# Altium project Rpiadapter_V3.PrjPcb
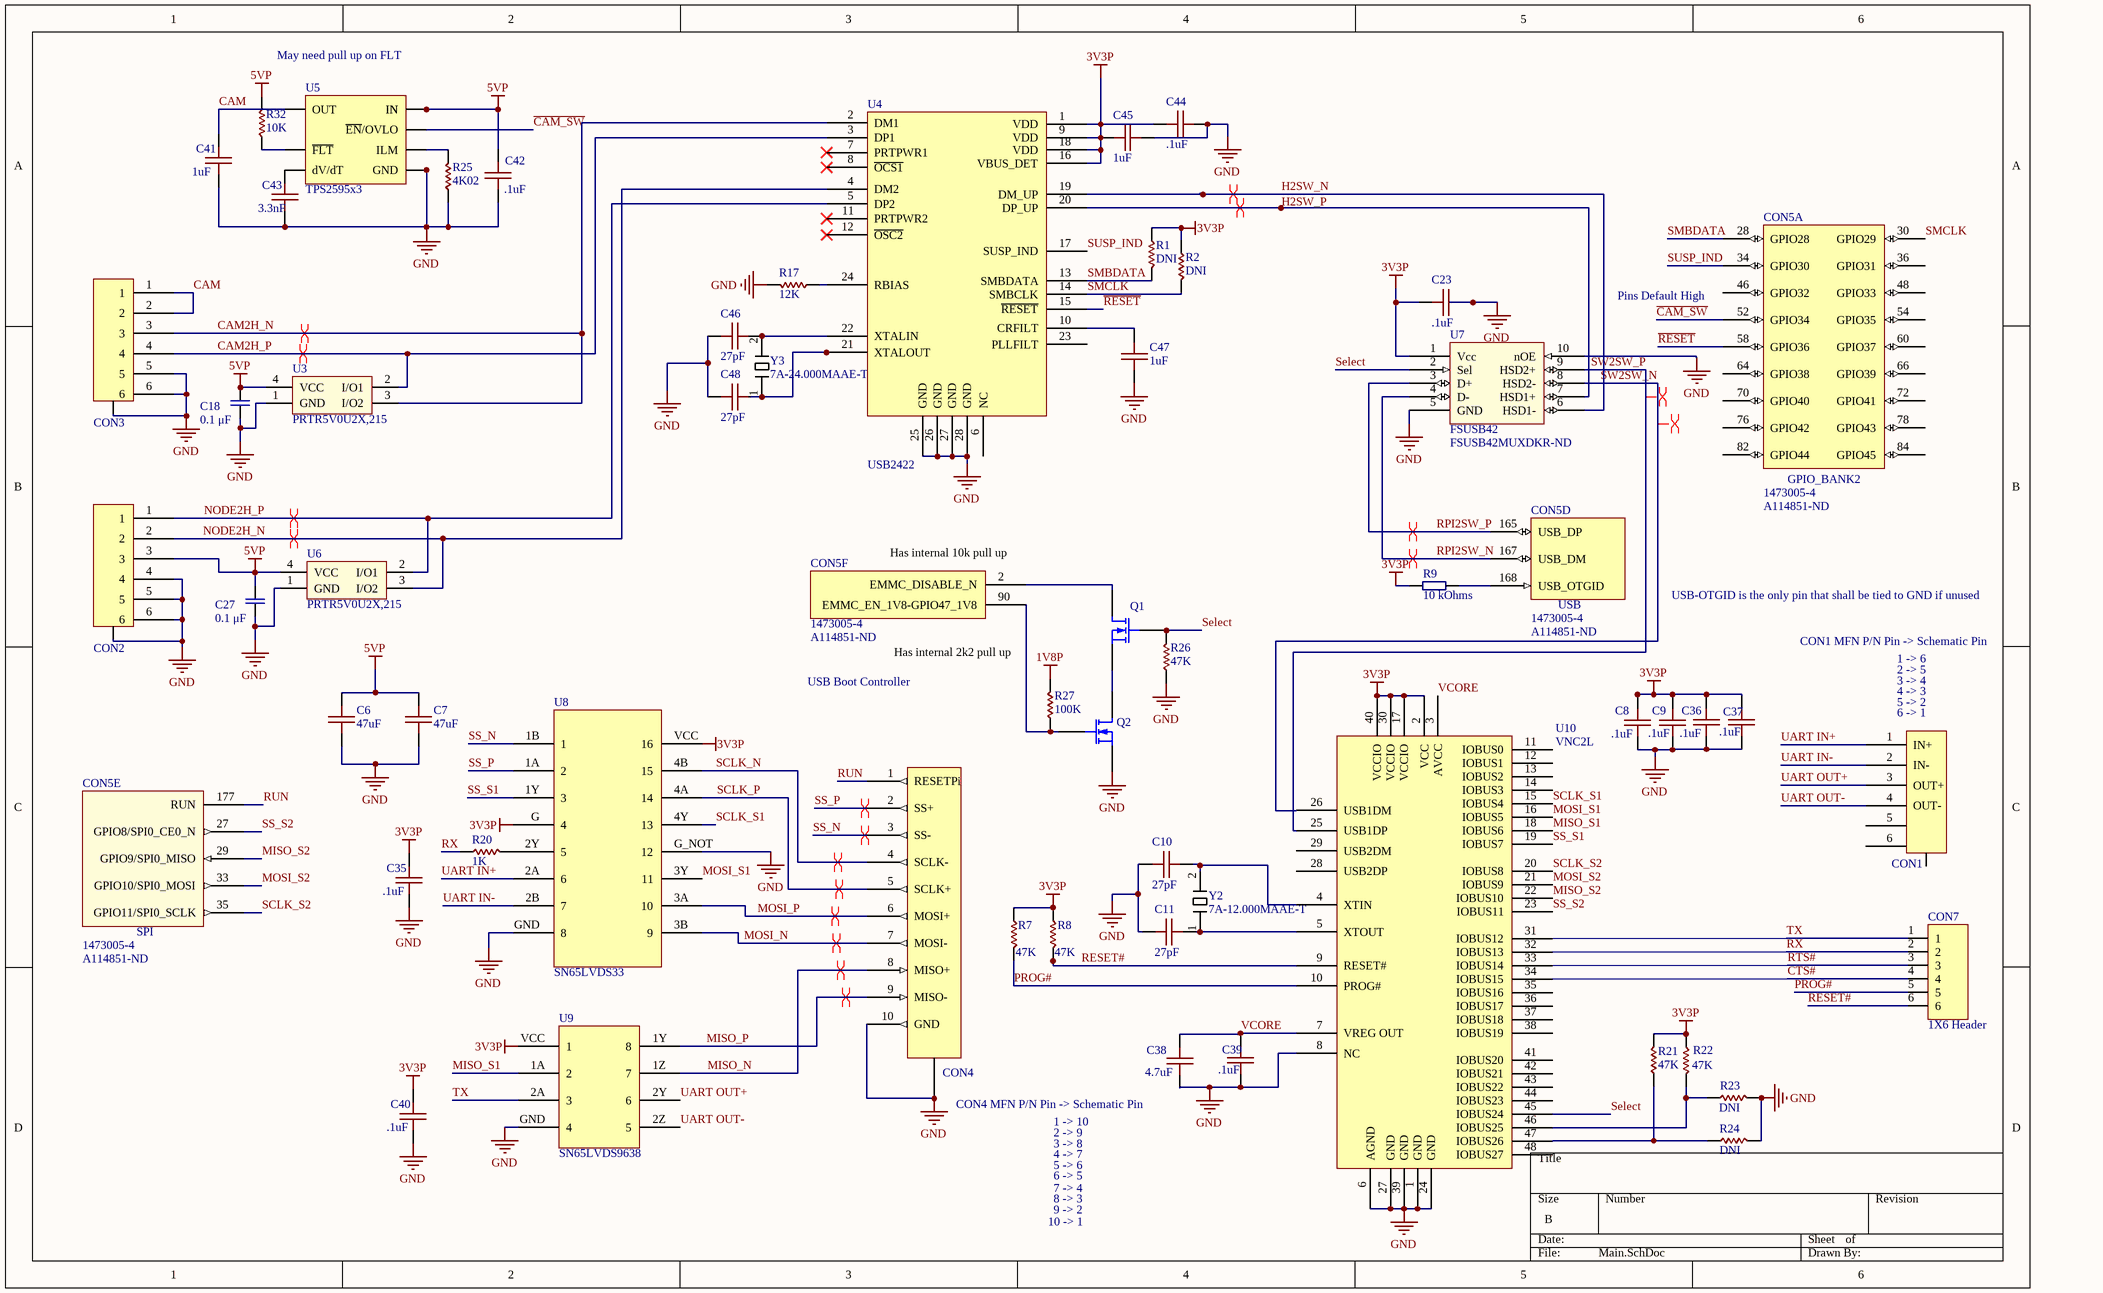
[diagram p0: Main.SchDoc]
3 sheets, 86 parts. Net scope: global (net labels, ports and power ports of the same name join across sheets).
Board file: RPIadaptor.PcbDoc
Sheets:
  Main.SchDoc
  Misc.SchDoc
  Power.SchDoc

## Sheet Main.SchDoc
size B

### Parts
C6  47uF  [0805 B]
C7  47uF  [0805 B]
C8  .1uF  [0402 B]
C9  .1uF  [0603 B]
C10  27pF  [0402 B]
C11  27pF  [0402 B]
C18  Capacitance: 0.1 μF  [0805_X7R_KEMET]  (hidden comment: C0805C104K5RACTU)
C23  .1uF  [0402 B]
C27  Capacitance: 0.1 μF  [0805_X7R_KEMET]  (hidden comment: C0805C104K5RACTU)
C35  .1uF  [0402 B]
C36  .1uF  [0402 B]
C37  .1uF  [0402 B]
C38  4.7uF  [0805 B]
C39  .1uF  [0402 B]
C40  .1uF  [0402 B]
C41  1uF  [0402 B]
C42  .1uF  [0402 B]
C43  3.3nF  [0402 B]
C44  .1uF  [0402 B]
C45  1uF  [0402 B]
C46  27pF  [0402 B]
C47  1uF  [0402 B]
C48  27pF  [0402 B]
CON1  T1M-06-F-SH-L-K  [T1M-06-F-SH-L-K]  (value not drawn)
CON2  T1M-06-F-SH-L-K  [T1M-06-F-SH-L-K]  (value not drawn)
CON3  0532610671  [0532610671]  (value not drawn)
CON4  T1M-10-F-SH-L-K  [T1M-10-F-SH-L-K]  (value not drawn)
CON5  1473005-4  Supplier Part Number 1: A114851-ND  [SODIMM SOCKET .6 PITCH 200 POS RIGHT ANGLE]  (parts A,D,E,F of 9)
CON7  1X6 Header  [1X6 HEADER]
Q1  DMG1012T-7  [SOT523]  (value not drawn)
Q2  DMG1012T-7  [SOT523]  (value not drawn)
R1  DNI  [0402]
R2  DNI  [0402]
R7  47K  [0402]
R8  47K  [0402]
R9  Resistance: 10 kOhms  [CRCW0805_VISHAY]  (hidden comment: jcc)
R17  12K  [0402]
R20  1K  [0402]
R21  47K  [0402]
R22  47K  [0402]
R23  DNI  [0402]
R24  DNI  [0402]
R25  4K02  [0402]
R26  47K  [0402]
R27  100K  [0402]
R32  10K  [0402]
U3  PRTR5V0U2X,215  [SOT143B]
U4  USB2422  [QFN-24]
U5  TPS2595x3  [SON8 (2x2)]
U6  PRTR5V0U2X,215  [SOT143B]
U7  FSUSB42  Supplier Part Number 1: FSUSB42MUXDKR-ND  [MSOP-10]
U8  SN65LVDS33  [SOIC127P820X265-8N]
U9  SN65LVDS9638  [SN65LVDS31]
U10  VNC2L  [VNC2L]
Y2  7A-12.000MAAE-T  [7A-12.000]
Y3  7A-24.000MAAE-T  [7A-12.000]

### Nets
1V8P: R27.1
3V3P: C8.1 C9.1 C23.1 C35.1 C36.1 C37.1 C40.1 C44.1 C45.1 R1.2 R2.2 R7.2 R8.2 R9.1 R21.1 R22.2 U4.1(VDD) U4.9(VDD) U4.16(VBUS_DET) U4.18(VDD) U7.1(Vcc) U8.G(4) U8.VCC(16) U9.VCC(1) U10.2(VCC) U10.17(VCCIO) U10.30(VCCIO) U10.40(VCCIO)
5VP: C6.2 C7.2 C18.1 C27.1 C42.1 CON2.3 R32.1 U3.4(VCC) U5.3(IN) U5.4(IN) U6.4(VCC)
GND: C6.1 C7.1 C8.2 C9.2 C10.2 C11.2 C18.2 C23.2 C27.2 C35.2 C36.2 C37.2 C38.1 C39.2 C40.2 C41.2 C42.2 C43.2 C44.2 C45.2 C46.2 C47.2 C48.2 CON2.4 CON2.5 CON2.6 CON2.GND CON3.5 CON3.6 CON3.GND CON4.10(GND) CON4.GND Q2.3(S) R17.1 R23.1 R24.1 R25.2 R26.2 U3.1(GND) U4.25(GND) U4.26(GND) U4.27(GND) U4.28(GND) U5.8(GND) U5.9 U6.1(GND) U7.5(GND) U7.10(nOE) U8.G_NOT(12) U8.GND(8) U9.GND(4) U10.1(GND) U10.6(AGND) U10.8(NC) U10.24(GND) U10.27(GND) U10.39(GND)
~{CAM_SW}: CON5.52(GPIO34) U5.2(~{EN}/OVLO)
CAM: C41.1 CON3.1 CON3.2 U5.5(OUT)
CAM2H_N: CON3.3 U3.3(I/O2) U4.2(DM1)
CAM2H_P: CON3.4 U3.2(I/O1) U4.3(DP1)
CTS#: CON7.4 U10.34(IOBUS15)
H2SW_N: U4.19(DM_UP) U7.6(HSD1-)
H2SW_P: U4.20(DP_UP) U7.7(HSD1+)
MISO_N: CON4.8(MISO+) U9.1Z(7)
MISO_P: CON4.9(MISO-) U9.1Y(8)
MISO_S1: U9.1A(2) U10.18(IOBUS6)
MISO_S2: CON5.29(GPIO9/SPI0_MISO) U10.22(IOBUS10)
MOSI_N: CON4.7(MOSI-) U8.3B(9)
MOSI_P: CON4.6(MOSI+) U8.3A(10)
MOSI_S1: U8.3Y(11) U10.16(IOBUS5)
MOSI_S2: CON5.33(GPIO10/SPI0_MOSI) U10.21(IOBUS9)
NODE2H_N: CON2.2 U4.4(DM2) U6.3(I/O2)
NODE2H_P: CON2.1 U4.5(DP2) U6.2(I/O1)
PROG#: CON7.5 R7.1 U10.10(PROG#)
~{RESET}: CON5.58(GPIO36) U4.15(~{RESET})
RESET#: CON7.6 R8.1 U10.9(RESET#)
RPI2SW_N: CON5.167(USB_DM) U7.4(D-)
RPI2SW_P: CON5.165(USB_DP) U7.3(D+)
RTS#: CON7.3 U10.33(IOBUS14)
RUN: CON4.1(RESETPi) CON5.177(RUN)
RX: CON7.2 R20.2 U10.32(IOBUS13)
SCLK_N: CON4.4(SCLK-) U8.4B(15)
SCLK_P: CON4.5(SCLK+) U8.4A(14)
SCLK_S1: U8.4Y(13) U10.15(IOBUS4)
SCLK_S2: CON5.35(GPIO11/SPI0_SCLK) U10.20(IOBUS8)
Select: Q1.2(G) R26.1 U7.2(Sel) U10.45(IOBUS24)
SMBDATA: CON5.28(GPIO28) R1.1 U4.13(SMBDATA)
SMCLK: CON5.30(GPIO29) R2.1 U4.14(SMBCLK)
SS_N: CON4.3(SS-) U8.1B(1)
SS_P: CON4.2(SS+) U8.1A(2)
SS_S1: U8.1Y(3) U10.19(IOBUS7)
SS_S2: CON5.27(GPIO8/SPI0_CE0_N) U10.23(IOBUS11)
SUSP_IND: CON5.34(GPIO30) U4.17(SUSP_IND)
SW2SW_N: U7.8(HSD2-) U10.26(USB1DM)
SW2SW_P: U7.9(HSD2+) U10.25(USB1DP)
TX: CON7.1 U9.2A(3) U10.31(IOBUS12)
UART IN+: CON1.1(IN+) U8.2A(6)
UART IN-: CON1.2(IN-) U8.2B(7)
UART OUT+: CON1.3(OUT+) U9.2Y(6)
UART OUT-: CON1.4(OUT-) U9.2Z(5)
VCORE: C38.2 C39.1 U10.3(AVCC) U10.7(VREG_OUT)
NetC10_1: C10.1 U10.4(XTIN) Y2.2
NetC11_1: C11.1 U10.5(XTOUT) Y2.1
NetC43_1: C43.1 U5.1(dV/dT)
NetC46_1: C46.1 U4.22(XTALIN) Y3.2
NetC47_1: C47.1 U4.10(CRFILT)
NetC48_1: C48.1 U4.21(XTALOUT) Y3.1
NetCON5_2: CON5.2(EMMC_DISABLE_N) Q1.1(D)
NetCON5_90: CON5.90(EMMC_EN_1V8-GPIO47_1V8) Q2.2(G) R27.2
NetCON5_168: CON5.168(USB_OTGID) R9.2
NetQ1_3: Q1.3(S) Q2.1(D)
NetR17_2: R17.2 U4.24(RBIAS)
NetR20_1: R20.1 U8.2Y(5)
NetR21_2: R21.2 R24.2 U10.47(IOBUS26)
NetR22_1: R22.1 R23.2 U10.46(IOBUS25)
NetR25_1: R25.1 U5.7(ILM)
NetR32_2: R32.2 U5.6(~{FLT})

Not connected (* = marked no-connect by the designer): CON1 5 6 GND; CON5 36(GPIO31) 46(GPIO32) 48(GPIO33) 54(GPIO35) 60(GPIO37) 64(GPIO38) 66(GPIO39) 70(GPIO40) 72(GPIO41) 76(GPIO42) 78(GPIO43) 82(GPIO44) 84(GPIO45); U4 6(NC) 7(PRTPWR1)* 8(~{OCS1})* 11(PRTPWR2)* 12(~{OSC2})* 23(PLLFILT); U10 11(IOBUS0) 12(IOBUS1) 13(IOBUS2) 14(IOBUS3) 28(USB2DP) 29(USB2DM) 35(IOBUS16) 36(IOBUS17) 37(IOBUS18) 38(IOBUS19) 41(IOBUS20) 42(IOBUS21) 43(IOBUS22) 44(IOBUS23) 48(IOBUS27)

### Layout directives
differential pair: CAM2H_N, CAM2H_P, H2SW_N, H2SW_P, MISO_N, MISO_P, MOSI_N, MOSI_P, NODE2H_N, NODE2H_P, RPI2SW_N, RPI2SW_P, SCLK_N, SCLK_P, SS_N, SS_P, SW2SW_N, SW2SW_P

### Notes on the sheet
- May need pull up on FLT
- (near CON5) Pins Default High
- (near CON5) Has internal 10k pull up
- USB-OTGID is the only pin that shall be tied to GND if unused
- USB Boot Controller
- Has internal 2k2 pull up
- CON1 MFN P/N Pin -> Schematic Pin
- 1 -> 6
- 2 -> 5
- 3 -> 4
- (near CON1) 4 -> 3
- (near CON1) 5 -> 2
- (near CON1) 6 -> 1
- CON4 MFN P/N Pin -> Schematic Pin
- 1 -> 10
- 2 -> 9
- 3 -> 8
- 4 -> 7
- 5 -> 6
- 6 -> 5
- 10 -> 1
- 7 -> 4
- 8 -> 3
- 9 -> 2
- (in symbol 1473005-4, part A) GPIO_BANK2
- (in symbol 1473005-4, part D) USB
- (in symbol 1473005-4, part E) SPI

### Library data of the parts
C6 = CAP 0805: 0805 CAP; Value: 47uF; Parameter 1: *
C7 C38 = CAP 0805: 805 Capacitor
  C7: Value: 47uF
C8 C23 C35 C36 C40-C43 = CAP 0402
C9 = CAP 0603: 603 Capacitor
C10 C11 C37 C39 C46 C48 = CAP 0402: CBR04C680F3GAC
C18 C27 = C0805C104K5RACTU: Manufacturer: Kemet; Manufacturer Part Number: C0805C104K5RAC-TU; Brand/Series: C Series; Dielectric Characteristic: X7R; Material, Element: Ceramic; Tolerance: -10, +10 %; Voltage, Rating: 50 VDC; Supplier 1: Digikey; Stock 1: 2895664; Pricing 1: 1=0.1, 10=0.053, 25=0.0388, 50=0.029, 100=0.0237, 250=0.0198, 500=0.0169, 1000=0.0133 (USD); Case Size: 0805 (2012 mm); Dimensions: 0.079" x 0.049" (2 x 1.25mm) LxW; Mounting Type: PCB; Packaging: Cut Tape; Termination: SMD; ComponentLink1URL: https://datasheet.ciiva.com/14589/70095383-14589048.pdf; ComponentLink1Description: https://datasheet.ciiva.com/14589/70095383-14589048.pdf; ComponentLink2URL: https://datasheet.ciiva.com/28682/1851736-28682232.pdf; ComponentLink2Description: https://datasheet.ciiva.com/28682/1851736-28682232.pdf; ComponentLink3URL: https://datasheet.ciiva.com/7842/1851736-7842539.pdf; ComponentLink3Description: https://datasheet.ciiva.com/7842/1851736-7842539.pdf; ComponentLink4URL: https://datasheet.ciiva.com/32431/slceramic-chip-condensers-e-32431755.pdf; ComponentLink4Description: https://datasheet.ciiva.com/32431/slceramic-chip-condensers-e-32431755.pdf; ComponentLink5URL: https://datasheet.ciiva.com/18410/70095383-18410815.pdf; ComponentLink5Description: https://datasheet.ciiva.com/18410/70095383-18410815.pdf; Supplier Part Number 1: 399-1170-1-ND
C44 C45 = CAP 0402: 402 cap
C47 = CAP 0402: 402
CON1 CON2 = T1M-06-F-SH-L-K: 6 Positions Header Connector Surface Mount, Right Angle; Manufacturer: Samtec; Supplier 1: Digi-Key; Manufacturer Part Number: T1M-06-F-SH-L-K; Stock 1: 0; Supplier Part Number 1: SAM11991-ND
CON3 = 0532610671: CONN HEADER 6POS 1.25MM R/A SMD; Manufacturer: Molex; Number of Contacts: 6; Gender: HDR; Supplier 1: Digi-Key; Manufacturer Part Number: 0532610671; Stock 1: 23842; Supplier Part Number 1: WM7624CT-ND; Pricing 1: 1=1.37, 10=1.239, 100=1.0624, 500=0.8853 (USD); Packaging: Cut Tape; Type: Shrouded Header; Pitch: 1.25 mm; Number of Rows: 1; Contact Plating: Tin Over Nickel; Termination Method: Solder; Category: Connector Headers and PCB Receptacles; ComponentLink1URL: https://datasheet.ciiva.com/6813/532610671-sd-6813952.pdf; ComponentLink1Description: https://datasheet.ciiva.com/6813/532610671-sd-6813952.pdf; ComponentLink2URL: https://datasheet.ciiva.com/3933/353410532610671-pcb-headers-3933365.pdf; ComponentLink2Description: https://datasheet.ciiva.com/3933/353410532610671-pcb-headers-3933365.pdf; ComponentLink3URL: https://datasheet.ciiva.com/6813/532610671-sd-6813942.pdf; ComponentLink3Description: https://datasheet.ciiva.com/6813/532610671-sd-6813942.pdf; ComponentLink4URL: https://datasheet.ciiva.com/3117/0532610671-pcb-headers-3117609.pdf; ComponentLink4Description: https://datasheet.ciiva.com/3117/0532610671-pcb-headers-3117609.pdf; ComponentLink5URL: https://datasheet.ciiva.com/3117/0532610671-pcb-headers-3117610.pdf; ComponentLink5Description: https://datasheet.ciiva.com/3117/0532610671-pcb-headers-3117610.pdf; ComponentLink6URL: https://datasheet.ciiva.com/6813/532610671-sd-6813947.pdf; ComponentLink6Description: https://datasheet.ciiva.com/6813/532610671-sd-6813947.pdf; ComponentLink7URL: https://datasheet.ciiva.com/48768/0532610671-pcb-headers-48768267.pdf; ComponentLink7Description: https://datasheet.ciiva.com/48768/0532610671-pcb-headers-48768267.pdf
CON4 = T1M-10-F-SH-L-K: 10 Positions Header Connector Surface Mount, Right Angle
CON5 = 1473005-4: Manufacturer: TE Connectivity (Tyco Electronics); Unit PriceUSD: AMP; Minimum Quantity: SODIMM; 3D Model: 1473005-4.pdf; Number of Positions: 200; Memory Type: DDR 2 SDRAM; Other Names: 1473005-4-ND / A114851; Supplier 1: Digikey; Manufacturer Part Number: 1473005-4; Stock 1: 1922; Pricing 1: 1=3.9, 10=3.744, 50=3.276, 100=3.12, 250=2.73, 500=2.652, 1000=2.262, 2500=2.106 (USD); Quantity Available: Tray; RoHS Information: 1473005-4 Statement of Compliance / RoHS 2 Statement; Standard Package: 20; Category: Connectors, Interconnects; Family: Memory Connectors - Inline Module Sockets; Series: AMP; Packaging: Tray; Connector Style: SODIMM; Mounting Type: Surface Mount, Right Angle; Features: Board Guide, Latches; Mounting Feature: Standard; Contact Finish: Gold; Contact Finish Thickness: Flash; ComponentLink1URL: https://datasheet.ciiva.com/682/eng-cd-1473005-j2-682720.pdf; ComponentLink1Description: https://datasheet.ciiva.com/682/eng-cd-1473005-j2-682720.pdf; ComponentLink2URL: https://datasheet.ciiva.com/15171/getdatasheetpartid-99150-15171488.pdf; ComponentLink2Description: https://datasheet.ciiva.com/15171/getdatasheetpartid-99150-15171488.pdf; ComponentLink3URL: https://datasheet.ciiva.com/1105/582309-1105221.pdf; ComponentLink3Description: https://datasheet.ciiva.com/1105/582309-1105221.pdf; ComponentLink4URL: https://datasheet.ciiva.com/682/eng-cd-1473005-j2-682726.pdf; ComponentLink4Description: https://datasheet.ciiva.com/682/eng-cd-1473005-j2-682726.pdf; ComponentLink5URL: https://datasheet.ciiva.com/14156/04821302-14156311.pdf; ComponentLink5Description: https://datasheet.ciiva.com/14156/04821302-14156311.pdf; ComponentLink6URL: https://datasheet.ciiva.com/3136/eng-cd-1473005-j-3136060.pdf; ComponentLink6Description: https://datasheet.ciiva.com/3136/eng-cd-1473005-j-3136060.pdf; ComponentLink7URL: https://datasheet.ciiva.com/16380/eng-cd-1473005-j-16380909.pdf; ComponentLink7Description: https://datasheet.ciiva.com/16380/eng-cd-1473005-j-16380909.pdf; ComponentLink8URL: https://datasheet.ciiva.com/16651/eng-cd-1473005-j-16651646.pdf; ComponentLink8Description: https://datasheet.ciiva.com/16651/eng-cd-1473005-j-16651646.pdf
Q1 Q2 = DMG1012T-7: N-Channel MOSFET; Manufacturer: Diodes; Drain-Source On Resistance-Max: 400 mO; Drain-to-Source Voltage [Vdss]: 20 V; Qg Gate Charge: 0.74 nC; Rated Power Dissipation: 280 mW; Published: 8-Jun-2000; LatestRevisionDate: 17-Jul-2002; LatestRevisionNote: Re-released for DXP Platform.; PackageVersion: 1995/1996; PackageReference: E3; Publisher: Altium Limited; PackageDescription: TO, Flat Index; 3 In-Line, Axial Leads; Body Dia. 4.6mm; Lead Dia. 0.5 mm (max); Supplier 1: Digikey; Manufacturer Part Number: DMG1012T-7; Stock 1: 327; Pricing 1: 1=0.33, 10=0.268, 100=0.1421, 500=0.0935, 1000=0.0636 (USD); Channel Type: N-Channel; ComponentLink1URL: https://datasheet.ciiva.com/934/ds31783-934512.pdf; ComponentLink1Description: https://datasheet.ciiva.com/934/ds31783-934512.pdf; ComponentLink2URL: https://datasheet.ciiva.com/4442/ds31783-44973-4442944.pdf; ComponentLink2Description: https://datasheet.ciiva.com/4442/ds31783-44973-4442944.pdf; ComponentLink3URL: https://datasheet.ciiva.com/11174/ds31783-11174965.pdf; ComponentLink3Description: https://datasheet.ciiva.com/11174/ds31783-11174965.pdf; ComponentLink4URL: https://datasheet.ciiva.com/17324/ds31783-17324010.pdf; ComponentLink4Description: https://datasheet.ciiva.com/17324/ds31783-17324010.pdf; ComponentLink5URL: https://datasheet.ciiva.com/6383/ds31783-6383803.pdf; ComponentLink5Description: https://datasheet.ciiva.com/6383/ds31783-6383803.pdf; ComponentLink6URL: https://datasheet.ciiva.com/934/ds31783-934511.pdf; ComponentLink6Description: https://datasheet.ciiva.com/934/ds31783-934511.pdf; Supplier Part Number 1: DMG1012T-7DICT-ND
R1 R2 R7 R8 R17 R20-R27 R32 = RES 0402: 402 Resistor
R9 = CRCW080510K0FKEA_ESTE: Manufacturer: Vishay; Brand: Vishay / Dale; Power Rating: 125 mW (1/8 W); Tolerance: 1 %; Temperature Coefficient: 100 PPM / K; Voltage Rating: 150 V; Case Height: 0.45 mm; Case Length: 2 mm; Case Width: 1.25 mm; Unit Weight: 0.000194 oz; Supplier 1: Digikey; Manufacturer Part Number: CRCW080510K0FKEA; Stock 1: 0; Pricing 1: 1=0.1, 10=0.042, 25=0.0304, 50=0.0232, 100=0.017, 250=0.013, 500=0.0104, 1000=0.0077 (USD); Product Category: Thick Film Resistors - SMD; RoHS: Details; Case Code - in: 0805; Case Code - mm: 2012; Operating Temperature Range: - 55 C to + 155 C; Package / Case: 0805 (2012 metric); Packaging: Reel; Product: Thick Film Resistors SMD; Series: CRCW; Factory Pack Quantity: 5000; ComponentLink1URL: https://datasheet.ciiva.com/5547/dcrcwe3-109170-5547559.pdf; ComponentLink1Description: https://datasheet.ciiva.com/5547/dcrcwe3-109170-5547559.pdf; ComponentLink2URL: https://datasheet.ciiva.com/11808/0900766b80d98b26-11808216.pdf; ComponentLink2Description: https://datasheet.ciiva.com/11808/0900766b80d98b26-11808216.pdf; ComponentLink3URL: https://datasheet.ciiva.com/16719/70201119-16719082.pdf; ComponentLink3Description: https://datasheet.ciiva.com/16719/70201119-16719082.pdf; ComponentLink4URL: https://datasheet.ciiva.com/16514/dcrcwe3-16514907.pdf; ComponentLink4Description: https://datasheet.ciiva.com/16514/dcrcwe3-16514907.pdf; ComponentLink5URL: https://datasheet.ciiva.com/16883/dcrcwe3-16883708.pdf; ComponentLink5Description: https://datasheet.ciiva.com/16883/dcrcwe3-16883708.pdf; ComponentLink6URL: https://datasheet.ciiva.com/8337/dcrcwe3-8337773.pdf; ComponentLink6Description: https://datasheet.ciiva.com/8337/dcrcwe3-8337773.pdf; ComponentLink7URL: https://datasheet.ciiva.com/16755/70201119-16755389.pdf; ComponentLink7Description: https://datasheet.ciiva.com/16755/70201119-16755389.pdf; ComponentLink8URL: https://datasheet.ciiva.com/46394/1720486-46394381.pdf; ComponentLink8Description: https://datasheet.ciiva.com/46394/1720486-46394381.pdf; ComponentLink9URL: https://datasheet.ciiva.com/8337/dcrcwe3-8337774.pdf; ComponentLink9Description: https://datasheet.ciiva.com/8337/dcrcwe3-8337774.pdf; ComponentLink10URL: https://datasheet.ciiva.com/16199/dcrcwe3-16199086.pdf; ComponentLink10Description: https://datasheet.ciiva.com/16199/dcrcwe3-16199086.pdf; Supplier Part Number 1: 541-10.0KCCT-ND
U3 U6 = PRTR5V0U2X,215: TVS DIODE 5.5VWM SOT143B; Manufacturer: NXP Semiconductors; Capacitance Value: 16pF; Configuration: Quad; Direction Type: Uni-Directional; ESD Protection Voltage: 8KV@Contact Disc; Leakage Current: 0.1uA; Number of  Elements: 1; Product Depth (mm): 1.4 mm; Product Height (mm): 1 mm; Product Length (mm): 3 mm; Rad Hardened: No; Reverse Breakdown Voltage: 6 V; Reverse Stand-off Voltage: 5.5 V; Suppressor Type: Diode Arrays; Working Voltage: 5.5V; Supplier 1: Digi-Key; Manufacturer Part Number: PRTR5V0U2X,215; Stock 1: 73838; Pricing 1: 1=0.52, 10=0.447, 100=0.334, 500=0.2624, 1000=0.2028 (USD); Leakage Current (Max): 0.1uA; Mounting: Surface Mount; Mounting Style: Surface Mount; Operating Temp Range: -40C to 85C; Operating Temperature Classification: Industrial; Operating Temperature Max Deg. C: 85C; Operating Temperature Min Deg. C: -40C; Package / Case: SOT; Package Type: SOT; Packaging: Tape and Reel; Pin Count: 3 +Tab; Polarity: Uni-Directional; Working Voltage (Max): 5.5V; ComponentLink1URL: https://datasheet.ciiva.com/4479/prtr5v0u2x-102853-4479461.pdf; ComponentLink1Description: https://datasheet.ciiva.com/4479/prtr5v0u2x-102853-4479461.pdf; ComponentLink2URL: https://datasheet.ciiva.com/16199/prtr5v0u2x-16199605.pdf; ComponentLink2Description: https://datasheet.ciiva.com/16199/prtr5v0u2x-16199605.pdf; ComponentLink3URL: https://datasheet.ciiva.com/28409/109718-28409830.pdf; ComponentLink3Description: https://datasheet.ciiva.com/28409/109718-28409830.pdf; ComponentLink4URL: https://datasheet.ciiva.com/6918/109718-6918650.pdf; ComponentLink4Description: https://datasheet.ciiva.com/6918/109718-6918650.pdf; ComponentLink5URL: https://datasheet.ciiva.com/335/prtr5v0u2x-335467.pdf; ComponentLink5Description: https://datasheet.ciiva.com/335/prtr5v0u2x-335467.pdf; ComponentLink6URL: https://datasheet.ciiva.com/25919/prtr5v0u2x-25919147.pdf; ComponentLink6Description: https://datasheet.ciiva.com/25919/prtr5v0u2x-25919147.pdf; ComponentLink7URL: https://datasheet.ciiva.com/11193/prtr5v0u2x-11193230.pdf; ComponentLink7Description: https://datasheet.ciiva.com/11193/prtr5v0u2x-11193230.pdf; ComponentLink8URL: https://datasheet.ciiva.com/31402/109718-31402206.pdf; ComponentLink8Description: https://datasheet.ciiva.com/31402/109718-31402206.pdf; ComponentLink9URL: https://datasheet.ciiva.com/26787/prtr5v0u2x-215-26787348.pdf; ComponentLink9Description: https://datasheet.ciiva.com/26787/prtr5v0u2x-215-26787348.pdf; Supplier Part Number 1: 1727-3884-1-ND
U7 = FSUSB42: 2 ports USB switch; Manufacturer: Fairchild Semiconductor; Manufacturer Part Number: FSUSB42MUX; Multiplexer Configuration: Single DPDT; Number of Inputs: 2; Number of Outputs: 4; Number of Channels: 1; Analog Switch ON Resistance: 6.5@3VOhm; Analog Switch Turn On Time: 13(Typ)@3.3Vns; Analog Switch Turn Off Time: 12(Typ)@3.3Vns; Power Supply Requirement: Single; Single Supply Voltage (Min): 3V; Single Supply Voltage (Max): 4.4V; Dual Supply Voltage (Min): Not RequiredV; Supplier 1: Digikey; Stock 1: 2789; Pricing 1: 1=0.62, 10=0.544, 100=0.4169, 500=0.3296, 1000=0.2637 (USD); Package Type: MSOP; Packaging: Tape and Reel; Dual Supply Voltage (Typ): Not RequiredV; Dual Supply Voltage (Max): Not RequiredV; Mounting: Surface Mount; Pin Count: 10; Operating Temp Range: -40C to 85C; Operating Temperature Classification: Industrial; ComponentLink1URL: https://datasheet.ciiva.com/26074/fsusb42-26074738.pdf; ComponentLink1Description: https://datasheet.ciiva.com/26074/fsusb42-26074738.pdf; ComponentLink2URL: https://datasheet.ciiva.com/3232/fsusb42-3232662.pdf; ComponentLink2Description: https://datasheet.ciiva.com/3232/fsusb42-3232662.pdf; ComponentLink3URL: https://datasheet.ciiva.com/3233/fsusb42-3233258.pdf; ComponentLink3Description: https://datasheet.ciiva.com/3233/fsusb42-3233258.pdf; ComponentLink4URL: https://datasheet.ciiva.com/1666/fsusb42-1666347.pdf; ComponentLink4Description: https://datasheet.ciiva.com/1666/fsusb42-1666347.pdf; ComponentLink5URL: https://datasheet.ciiva.com/1666/fsusb42-1666348.pdf; ComponentLink5Description: https://datasheet.ciiva.com/1666/fsusb42-1666348.pdf; ComponentLink6URL: https://datasheet.ciiva.com/1666/fsusb42-1666349.pdf; ComponentLink6Description: https://datasheet.ciiva.com/1666/fsusb42-1666349.pdf; ComponentLink7URL: https://datasheet.ciiva.com/4924/fsusb42-112719-4924269.pdf; ComponentLink7Description: https://datasheet.ciiva.com/4924/fsusb42-112719-4924269.pdf
U8 = SN65LVDS33: pin to pad: 1A>2 1B>1 1Y>3 2A>6 2B>7 2Y>5 3A>10 3B>9 3Y>11 4A>14 4B>15 4Y>13 G>4 G_NOT>12 GND>8 VCC>16
U9 = SN65LVDS9638: pin to pad: 1A>2 1Y>8 1Z>7 2A>3 2Y>6 2Z>5 GND>4 VCC>1
Y3 = 7A-12.000MAAE-T

## Sheet Misc.SchDoc
size A3
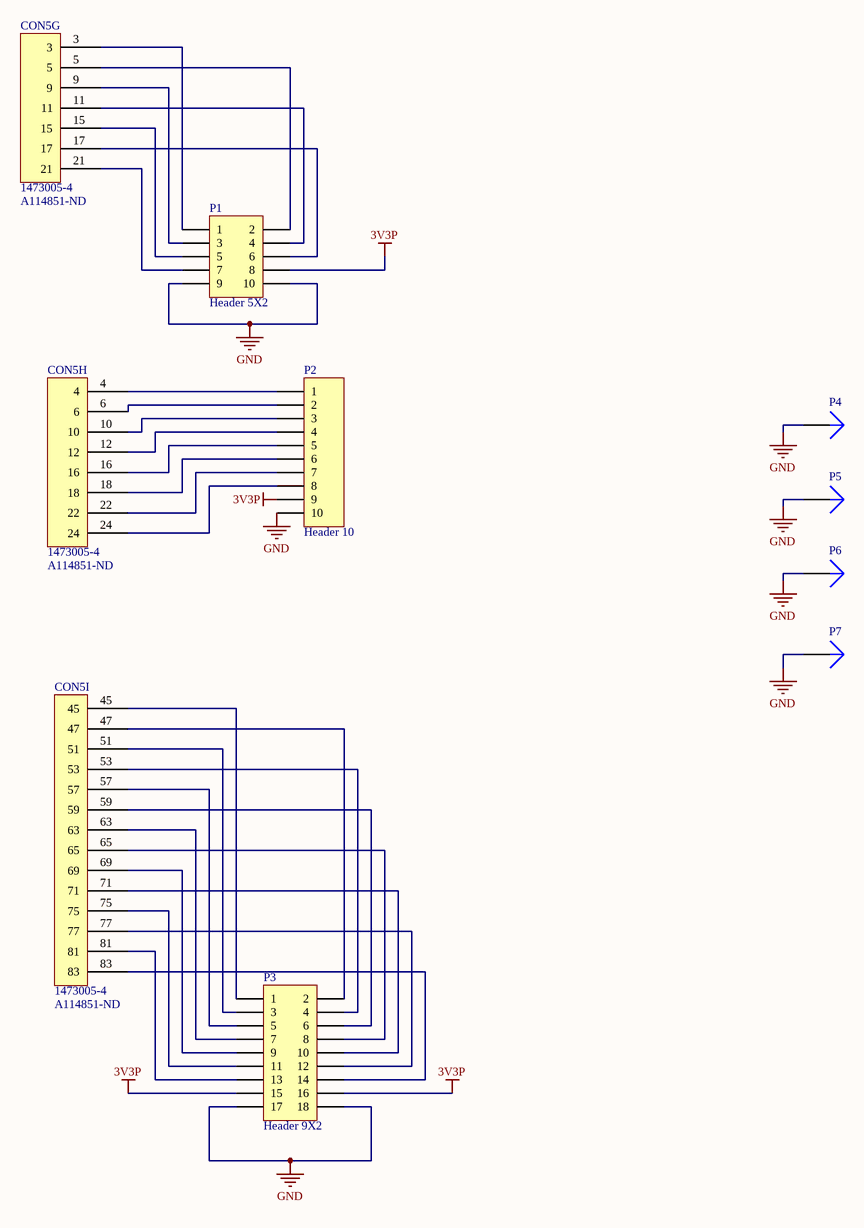
[diagram p1: Misc.SchDoc]

### Parts
CON5  1473005-4  Supplier Part Number 1: A114851-ND  [SODIMM SOCKET .6 PITCH 200 POS RIGHT ANGLE]  (parts G,H,I of 9)
P1  Header 5X2  [HDR2X5]
P2  Header 10  [HDR1X10]
P3  Header 9X2  [HDR2X9]
P4  Plug  [PIN1]  (value not drawn)
P5  Plug  [PIN1]  (value not drawn)
P6  Plug  [PIN1]  (value not drawn)
P7  Plug  [PIN1]  (value not drawn)

### Nets
3V3P: P1.8 P2.9 P3.15 P3.16
GND: P1.9 P1.10 P2.10 P3.17 P3.18 P4.1 P5.1 P6.1 P7.1
NetCON5_3: CON5.3 P1.1
NetCON5_4: CON5.4 P2.1
NetCON5_5: CON5.5 P1.2
NetCON5_6: CON5.6 P2.2
NetCON5_9: CON5.9 P1.3
NetCON5_10: CON5.10 P2.3
NetCON5_11: CON5.11 P1.4
NetCON5_12: CON5.12 P2.4
NetCON5_15: CON5.15 P1.5
NetCON5_16: CON5.16 P2.5
NetCON5_17: CON5.17 P1.6
NetCON5_18: CON5.18 P2.6
NetCON5_21: CON5.21 P1.7
NetCON5_22: CON5.22 P2.7
NetCON5_24: CON5.24 P2.8
NetCON5_45: CON5.45 P3.1
NetCON5_47: CON5.47 P3.2
NetCON5_51: CON5.51 P3.3
NetCON5_53: CON5.53 P3.4
NetCON5_57: CON5.57 P3.5
NetCON5_59: CON5.59 P3.6
NetCON5_63: CON5.63 P3.7
NetCON5_65: CON5.65 P3.8
NetCON5_69: CON5.69 P3.9
NetCON5_71: CON5.71 P3.10
NetCON5_75: CON5.75 P3.11
NetCON5_77: CON5.77 P3.12
NetCON5_81: CON5.81 P3.13
NetCON5_83: CON5.83 P3.14

### Library data of the parts
CON5 = 1473005-4: as CON5 on sheet Main; Supplier 1: Digikey; Manufacturer Part Number: 1473005-4; Stock 1: 1922; Pricing 1: 1=3.9, 10=3.744, 50=3.276, 100=3.12, 250=2.73, 500=2.652, 1000=2.262, 2500=2.106 (USD); Quantity Available: Tray; RoHS Information: 1473005-4 Statement of Compliance / RoHS 2 Statement; Standard Package: 20; Category: Connectors, Interconnects; Family: Memory Connectors - Inline Module Sockets; Series: AMP; Packaging: Tray; Connector Style: SODIMM; Mounting Type: Surface Mount, Right Angle; Features: Board Guide, Latches; Mounting Feature: Standard; Contact Finish: Gold; Contact Finish Thickness: Flash; ComponentLink1URL: https://datasheet.ciiva.com/682/eng-cd-1473005-j2-682720.pdf; ComponentLink1Description: https://datasheet.ciiva.com/682/eng-cd-1473005-j2-682720.pdf; ComponentLink2URL: https://datasheet.ciiva.com/15171/getdatasheetpartid-99150-15171488.pdf; ComponentLink2Description: https://datasheet.ciiva.com/15171/getdatasheetpartid-99150-15171488.pdf; ComponentLink3URL: https://datasheet.ciiva.com/1105/582309-1105221.pdf; ComponentLink3Description: https://datasheet.ciiva.com/1105/582309-1105221.pdf; ComponentLink4URL: https://datasheet.ciiva.com/682/eng-cd-1473005-j2-682726.pdf; ComponentLink4Description: https://datasheet.ciiva.com/682/eng-cd-1473005-j2-682726.pdf; ComponentLink5URL: https://datasheet.ciiva.com/14156/04821302-14156311.pdf; ComponentLink5Description: https://datasheet.ciiva.com/14156/04821302-14156311.pdf; ComponentLink6URL: https://datasheet.ciiva.com/3136/eng-cd-1473005-j-3136060.pdf; ComponentLink6Description: https://datasheet.ciiva.com/3136/eng-cd-1473005-j-3136060.pdf; ComponentLink7URL: https://datasheet.ciiva.com/16380/eng-cd-1473005-j-16380909.pdf; ComponentLink7Description: https://datasheet.ciiva.com/16380/eng-cd-1473005-j-16380909.pdf; ComponentLink8URL: https://datasheet.ciiva.com/16651/eng-cd-1473005-j-16651646.pdf; ComponentLink8Description: https://datasheet.ciiva.com/16651/eng-cd-1473005-j-16651646.pdf
P1 = Header 5X2: Header, 5-Pin, Dual row; LatestRevisionDate: 17-Jul-2002; LatestRevisionNote: Re-released for DXP Platform.; Publisher: Altium Limited
P2 = Header 10: Header, 10-Pin; LatestRevisionDate: 17-Jul-2002; LatestRevisionNote: Re-released for DXP Platform.; Publisher: Altium Limited
P3 = Header 9X2: Header, 9-Pin, Dual row; LatestRevisionDate: 17-Jul-2002; LatestRevisionNote: Re-released for DXP Platform.; Publisher: Altium Limited
P4-P7 = Plug: LatestRevisionDate: 17-Jul-2002; LatestRevisionNote: Re-released for DXP Platform.; Publisher: Altium Limited

## Sheet Power.SchDoc
size A
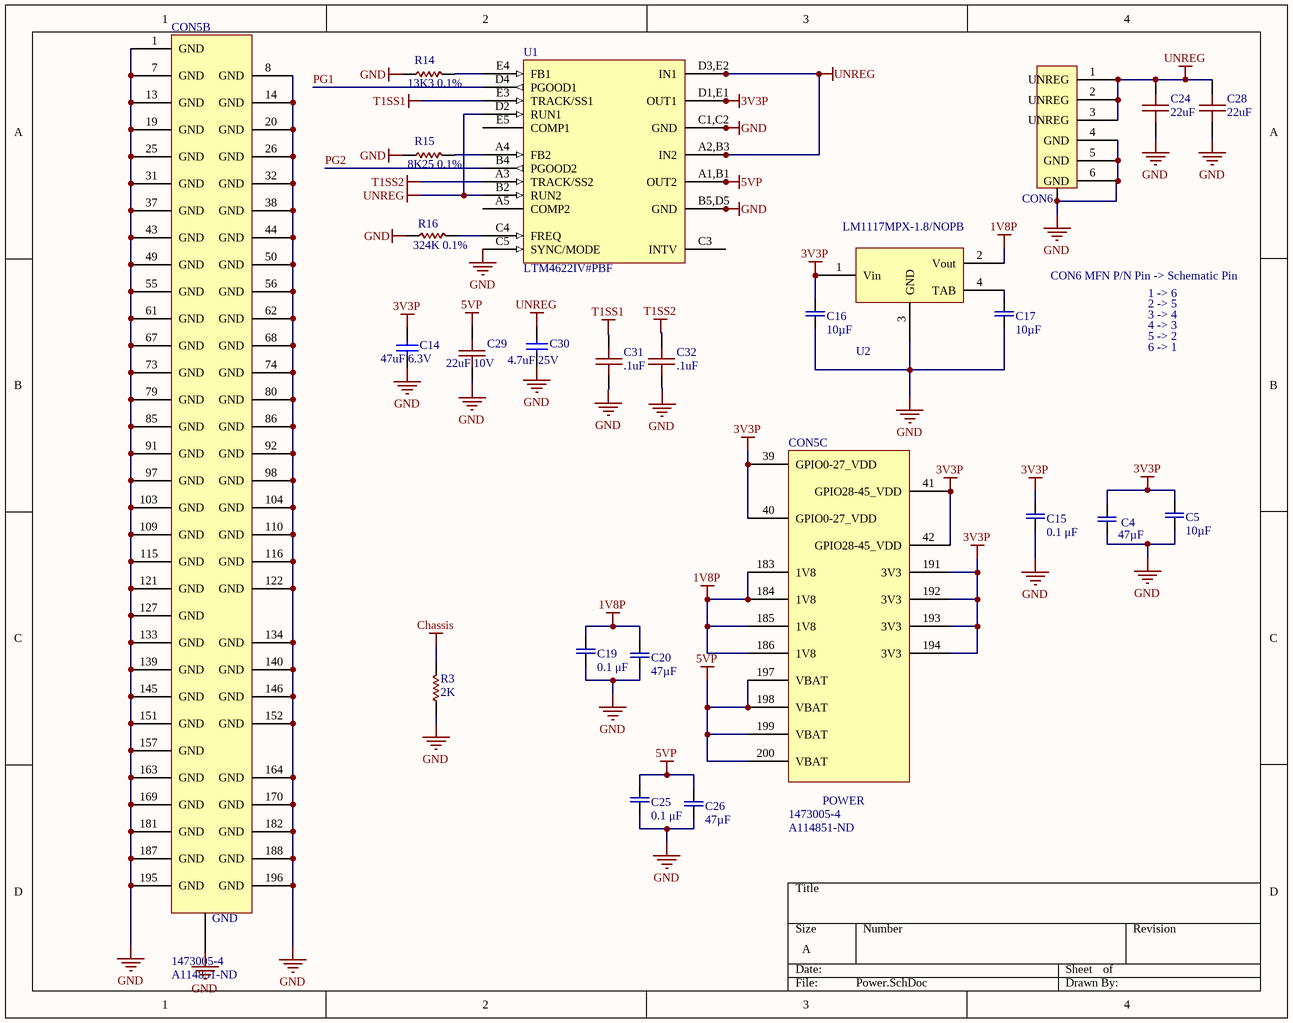
[diagram p2: Power.SchDoc]

### Parts
C4  Capacitance: 47µF  [1210_X7R_KEMET_above4.7uF]  (hidden comment: C1210C476M8RAC7800)
C5  Capacitance: 10µF  [0805_X7R_KEMET]  (hidden comment: C0805C106M8RACTU)
C14  47uF 6.3V  [CAPC0805(2012)145_M]
C15  Capacitance: 0.1 μF  [0805_X7R_KEMET]  (hidden comment: C0805C104K5RACTU)
C16  Capacitance: 10µF  [0805_X7R_KEMET]  (hidden comment: C0805C106M8RACTU)
C17  Capacitance: 10µF  [0805_X7R_KEMET]  (hidden comment: C0805C106M8RACTU)
C19  Capacitance: 0.1 μF  [0805_X7R_KEMET]  (hidden comment: C0805C104K5RACTU)
C20  Capacitance: 47µF  [1210_X7R_KEMET_above4.7uF]  (hidden comment: C1210C476M8RAC7800)
C24  22uF  [0805 B]
C25  Capacitance: 0.1 μF  [0805_X7R_KEMET]  (hidden comment: C0805C104K5RACTU)
C26  Capacitance: 47µF  [1210_X7R_KEMET_above4.7uF]  (hidden comment: C1210C476M8RAC7800)
C28  22uF  [0805 B]
C29  22uF 10V  [0805 B]
C30  4.7uF 25V  [CAPC0603(1608)100_N]
C31  .1uF  [0402 B]
C32  .1uF  [0402 B]
CON5  1473005-4  Supplier Part Number 1: A114851-ND  [SODIMM SOCKET .6 PITCH 200 POS RIGHT ANGLE]  (parts B,C of 9)
CON6  T1M-06-F-SH-L-K  [T1M-06-F-SH-L-K]  (value not drawn)
R3  2K  [0402]
R14  13K3 0.1%  [0402]
R15  8K25 0.1%  [0402]
R16  324K 0.1%  [0603]
U1  LTM4622IV#PBF  [LGA 25]
U2  LM1117MPX-1.8/NOPB  [SOT230P700X180-4N]

### Nets
1V8P: C19.1 C20.1 CON5.183(1V8) CON5.184(1V8) CON5.185(1V8) CON5.186(1V8) U2.2(Vout)
3V3P: C4.1 C5.1 C14.2 C15.1 C16.1 CON5.39(GPIO0-27_VDD) CON5.40(GPIO0-27_VDD) CON5.41(GPIO28-45_VDD) CON5.42(GPIO28-45_VDD) CON5.191(3V3) CON5.192(3V3) CON5.193(3V3) CON5.194(3V3) U1.D1,E1(OUT1) U1.E1(OUT1) U2.1(Vin)
5VP: C25.1 C26.1 C29.2 CON5.197(VBAT) CON5.198(VBAT) CON5.199(VBAT) CON5.200(VBAT) U1.A1,B1(OUT2) U1.B1(OUT2)
Chassis: R3.1
GND: C4.2 C5.2 C14.1 C15.2 C16.2 C17.2 C19.2 C20.2 C24.1 C25.2 C26.2 C28.1 C29.1 C30.1 C31.1 C32.1 CON5.1(GND) CON5.7(GND) CON5.8(GND) CON5.13(GND) CON5.14(GND) CON5.19(GND) CON5.20(GND) CON5.25(GND) CON5.26(GND) CON5.31(GND) CON5.32(GND) CON5.37(GND) CON5.38(GND) CON5.43(GND) CON5.44(GND) CON5.49(GND) CON5.50(GND) CON5.55(GND) CON5.56(GND) CON5.61(GND) CON5.62(GND) CON5.67(GND) CON5.68(GND) CON5.73(GND) CON5.74(GND) CON5.79(GND) CON5.80(GND) CON5.85(GND) CON5.86(GND) CON5.91(GND) CON5.92(GND) CON5.97(GND) CON5.98(GND) CON5.103(GND) CON5.104(GND) CON5.109(GND) CON5.110(GND) CON5.115(GND) CON5.116(GND) CON5.121(GND) CON5.122(GND) CON5.127(GND) CON5.133(GND) CON5.134(GND) CON5.139(GND) CON5.140(GND) CON5.145(GND) CON5.146(GND) CON5.151(GND) CON5.152(GND) CON5.157(GND) CON5.163(GND) CON5.164(GND) CON5.169(GND) CON5.170(GND) CON5.181(GND) CON5.182(GND) CON5.187(GND) CON5.188(GND) CON5.195(GND) CON5.196(GND) CON5.GND CON6.4(GND) CON6.5(GND) CON6.6(GND) CON6.GND R3.2 R14.2 R15.2 R16.2 U1.B5,D5(GND) U1.C1,C2(GND) U1.C2(GND) U1.C5(SYNC/MODE) U1.D5(GND) U2.3(GND)
T1SS1: C31.2 U1.E3(TRACK/SS1)
T1SS2: C32.2 U1.A3(TRACK/SS2)
UNREG: C24.2 C28.2 C30.2 CON6.1(UNREG) CON6.2(UNREG) CON6.3(UNREG) U1.A2,B3(IN2) U1.B2(RUN2) U1.B3(IN2) U1.D2(RUN1) U1.D3,E2(IN1) U1.E2(IN1)
PG1: U1.D4(PGOOD1)
PG2: U1.B4(PGOOD2)
NetC17_1: C17.1 U2.4(TAB)
NetR14_1: R14.1 U1.E4(FB1)
NetR15_1: R15.1 U1.A4(FB2)
NetR16_1: R16.1 U1.C4(FREQ)

Not connected (* = marked no-connect by the designer): U1 A5(COMP2) C3(INTV) E5(COMP1)

### Notes on the sheet
- CON6 MFN P/N Pin -> Schematic Pin
- 1 -> 6
- 2 -> 5
- 3 -> 4
- 4 -> 3
- 5 -> 2
- 6 -> 1
- (in symbol 1473005-4, part C) POWER

### Library data of the parts
C4 C20 C26 = C1210C476M8RAC7800: Manufacturer: Kemet; Tolerance: ±20%; Voltage - Rated: 10V; Temperature Coefficient: X7R; Supplier 1: Digikey; Manufacturer Part Number: C1210C476M8RAC7800; Stock 1: 9455; Pricing 1: 1=1.47, 10=1.159, 25=1.0628, 50=1.0046, 100=0.8694, 250=0.7728, 500=0.6569 (USD); Category: Capacitors; Family: Ceramic Capacitors; Series: C; Packaging: Tape &amp; Reel (TR); Mounting Type: Surface Mount, MLCC; Operating Temperature: -55°C ~ 125°C; Applications: General Purpose; Ratings: -; Package / Case: 1210 (3225 Metric); Size / Dimension: 0.126" L x 0.098" W (3.20mm x 2.50mm); Height - Seated (Max): -; Thickness (Max): 0.110" (2.80mm); Lead Spacing: -; Features: -; Lead Style: -; ComponentLink1URL: http://www.alliedelec.com/m/d/51f554c3dd800f51434b811e71a34895.pdf; ComponentLink1Description: http://www.alliedelec.com/m/d/51f554c3dd800f51434b811e71a34895.pdf; Supplier Part Number 1: 399-12072-1-ND
C5 C16 C17 = C0805C106M8RACTU: Manufacturer: Kemet; Capacitance Tolerance: ± 20%; Capacitor Case Style: 0805 [2012 Metric]; Dielectric Characteristic: X7R; Product Range: KEMET - C Series; SVHC: No SVHC (16-Jun-2014); Voltage Rating: 10V; Supplier 1: Digikey; Manufacturer Part Number: C0805C106M8RACTU; Stock 1: 17950; Pricing 1: 1=0.52, 10=0.362, 25=0.2972, 50=0.2536, 100=0.2174, 250=0.1811, 500=0.163, 1000=0.1377 (USD); Ceramic Capacitor Case: 0805 [2012 Metric]; MSL: MSL 1 - Unlimited; Operating Temperature Max: 125°C; Operating Temperature Min: -55°C; Packaging: Tape & Reel; ComponentLink1URL: https://datasheet.ciiva.com/5408/kem-c1002-x7r-smd-5408794.pdf; ComponentLink1Description: https://datasheet.ciiva.com/5408/kem-c1002-x7r-smd-5408794.pdf; Supplier Part Number 1: 399-7413-1-ND
C14 = CMP-1036-04876-1: GRM21BR60J476ME15L; Case-EIA: 0805; Case-Metric: 2012; Tolerance: Â±10%; Value: 4.7uF; Technology: SMT; Max Thickness: 1.45 mm; Rated Voltage: 6.3 V
C15 C19 C25 = C0805C104K5RACTU: as C18 on sheet Main; Supplier 1: Digikey; Stock 1: 2895664; Pricing 1: 1=0.1, 10=0.053, 25=0.0388, 50=0.029, 100=0.0237, 250=0.0198, 500=0.0169, 1000=0.0133 (USD); Case Size: 0805 (2012 mm); Dimensions: 0.079" x 0.049" (2 x 1.25mm) LxW; Mounting Type: PCB; Packaging: Cut Tape; Termination: SMD; ComponentLink1URL: https://datasheet.ciiva.com/14589/70095383-14589048.pdf; ComponentLink1Description: https://datasheet.ciiva.com/14589/70095383-14589048.pdf; ComponentLink2URL: https://datasheet.ciiva.com/28682/1851736-28682232.pdf; ComponentLink2Description: https://datasheet.ciiva.com/28682/1851736-28682232.pdf; ComponentLink3URL: https://datasheet.ciiva.com/7842/1851736-7842539.pdf; ComponentLink3Description: https://datasheet.ciiva.com/7842/1851736-7842539.pdf; ComponentLink4URL: https://datasheet.ciiva.com/32431/slceramic-chip-condensers-e-32431755.pdf; ComponentLink4Description: https://datasheet.ciiva.com/32431/slceramic-chip-condensers-e-32431755.pdf; ComponentLink5URL: https://datasheet.ciiva.com/18410/70095383-18410815.pdf; ComponentLink5Description: https://datasheet.ciiva.com/18410/70095383-18410815.pdf; Supplier Part Number 1: 399-1170-1-ND
C24 C28 C29 = CAP 0805: 805 Capacitor
C30 = CMP-1035-01192-1: GRM188C81E475KE11D; Value: 75pF; Case-Metric: 1608; Case-EIA: 0603; Tolerance: Â±10%; Technology: SMT; Rated Voltage: 25 V; Max Thickness: 1 mm
C31 C32 = CAP 0402: 402 Capacitor; Value: .1uF
CON5 = 1473005-4: as CON5 on sheet Main; Supplier 1: Digikey; Manufacturer Part Number: 1473005-4; Stock 1: 1922; Pricing 1: 1=3.9, 10=3.744, 50=3.276, 100=3.12, 250=2.73, 500=2.652, 1000=2.262, 2500=2.106 (USD); Quantity Available: Tray; RoHS Information: 1473005-4 Statement of Compliance / RoHS 2 Statement; Standard Package: 20; Category: Connectors, Interconnects; Family: Memory Connectors - Inline Module Sockets; Series: AMP; Packaging: Tray; Connector Style: SODIMM; Mounting Type: Surface Mount, Right Angle; Features: Board Guide, Latches; Mounting Feature: Standard; Contact Finish: Gold; Contact Finish Thickness: Flash; ComponentLink1URL: https://datasheet.ciiva.com/682/eng-cd-1473005-j2-682720.pdf; ComponentLink1Description: https://datasheet.ciiva.com/682/eng-cd-1473005-j2-682720.pdf; ComponentLink2URL: https://datasheet.ciiva.com/15171/getdatasheetpartid-99150-15171488.pdf; ComponentLink2Description: https://datasheet.ciiva.com/15171/getdatasheetpartid-99150-15171488.pdf; ComponentLink3URL: https://datasheet.ciiva.com/1105/582309-1105221.pdf; ComponentLink3Description: https://datasheet.ciiva.com/1105/582309-1105221.pdf; ComponentLink4URL: https://datasheet.ciiva.com/682/eng-cd-1473005-j2-682726.pdf; ComponentLink4Description: https://datasheet.ciiva.com/682/eng-cd-1473005-j2-682726.pdf; ComponentLink5URL: https://datasheet.ciiva.com/14156/04821302-14156311.pdf; ComponentLink5Description: https://datasheet.ciiva.com/14156/04821302-14156311.pdf; ComponentLink6URL: https://datasheet.ciiva.com/3136/eng-cd-1473005-j-3136060.pdf; ComponentLink6Description: https://datasheet.ciiva.com/3136/eng-cd-1473005-j-3136060.pdf; ComponentLink7URL: https://datasheet.ciiva.com/16380/eng-cd-1473005-j-16380909.pdf; ComponentLink7Description: https://datasheet.ciiva.com/16380/eng-cd-1473005-j-16380909.pdf; ComponentLink8URL: https://datasheet.ciiva.com/16651/eng-cd-1473005-j-16651646.pdf; ComponentLink8Description: https://datasheet.ciiva.com/16651/eng-cd-1473005-j-16651646.pdf
CON6 = T1M-06-F-SH-L-K: as CON1 on sheet Main; Supplier 1: Digi-Key; Manufacturer Part Number: T1M-06-F-SH-L-K; Stock 1: 0; Supplier Part Number 1: SAM11991-ND
R3 R14 R15 = RES 0402: 402 Resistor
R16 = RES 0603: 603 Resistor
U1 = LTM4622: Dual Ultrathin 2.5A or Single 5A Step-Down DC/DC μModule Regulator; Ref: LTM4622IV#PBF
U2 = LM1117MPX-1.8/NOPB: LDO; Manufacturer: Texas Instruments (TI) / National Semiconductor; DELETED: Compliant; Dropout Voltage@Current (Max): 1.2@100mA/1.25@500mA; Dropout Voltage@Current (Typ): 1.1@100mA/1.15@500mA; Input Voltage: 15 V; Line Regulation: 1mV; Number of Outputs: Single; Output Current: 1.5 A; Output Voltage: 1.8 V; Output Voltage Accuracy: ?1 %; Polarity Type: Positive; Quiescent Current (Max): 10 mA; Rad Hardened: No; Regulator Output Type: Fixed; Voltage Regulator Type: Linear; Supplier 1: Digikey; Manufacturer Part Number: LM1117MPX-1.8/NOPB; Stock 1: 19027; Pricing 1: 1=1.04, 10=0.927, 100=0.7225, 500=0.5969, 1000=0.4712 (USD); Input Voltage (Max): 15 V; Load Regulation: 1mV; Mounting: Surface Mount; Operating Temp Range: 0C to 125C; Operating Temperature Classification: Commercial; Package Type: SOT-223; Packaging: Tape and Reel; Pin Count: 3 +Tab; Topology: LDO; ComponentLink1URL: https://datasheet.ciiva.com/34302/1282521-34302144.pdf; ComponentLink1Description: https://datasheet.ciiva.com/34302/1282521-34302144.pdf; ComponentLink2URL: https://datasheet.ciiva.com/15111/getdatasheetpartid-112508-15111793.pdf; ComponentLink2Description: https://datasheet.ciiva.com/15111/getdatasheetpartid-112508-15111793.pdf; ComponentLink3URL: https://datasheet.ciiva.com/3223/lm1117-n-3223526.pdf; ComponentLink3Description: https://datasheet.ciiva.com/3223/lm1117-n-3223526.pdf; ComponentLink4URL: https://datasheet.ciiva.com/3223/lm1117-n-3223527.pdf; ComponentLink4Description: https://datasheet.ciiva.com/3223/lm1117-n-3223527.pdf; ComponentLink5URL: https://datasheet.ciiva.com/6591/lm1117-n-6591863.pdf; ComponentLink5Description: https://datasheet.ciiva.com/6591/lm1117-n-6591863.pdf; ComponentLink6URL: https://datasheet.ciiva.com/6591/lm1117-n-6591864.pdf; ComponentLink6Description: https://datasheet.ciiva.com/6591/lm1117-n-6591864.pdf; ComponentLink7URL: https://datasheet.ciiva.com/6591/lm1117-n-6591865.pdf; ComponentLink7Description: https://datasheet.ciiva.com/6591/lm1117-n-6591865.pdf; ComponentLink8URL: https://datasheet.ciiva.com/46386/1882372-46386047.pdf; ComponentLink8Description: https://datasheet.ciiva.com/46386/1882372-46386047.pdf; Supplier Part Number 1: LM1117MPX-1.8/NOPBCT-ND

## Nets that join several sheets
1V8P: Main (R27.1), Power (7 pins)
3V3P: Main (28 pins), Misc (P1.8 P2.9 P3.15 P3.16), Power (16 pins)
5VP: Main (11 pins), Power (9 pins)
GND: Main (57 pins), Misc (9 pins), Power (92 pins)